# EAGLE design manual lsm (EAGLE 9.2.2)
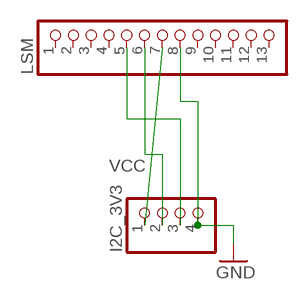
[diagram p0: schematic, sheet 1]

## Parts
I2C_3V3  PINHD-1X4  [1X04]
LSM  PINHD-1X13  [1X13]

## Nets
GND: I2C_3V3.4 LSM.8
N$1: I2C_3V3.2 LSM.6
N$2: I2C_3V3.3 LSM.5
VCC: I2C_3V3.1 LSM.7
Unconnected: LSM.1 LSM.2 LSM.3 LSM.4 LSM.9 LSM.10 LSM.11 LSM.12 LSM.13

## Library data of the parts
I2C_3V3 = pinhead:PINHD-1X4: PIN HEADER
LSM = pinhead:PINHD-1X13: PIN HEADER

## Board
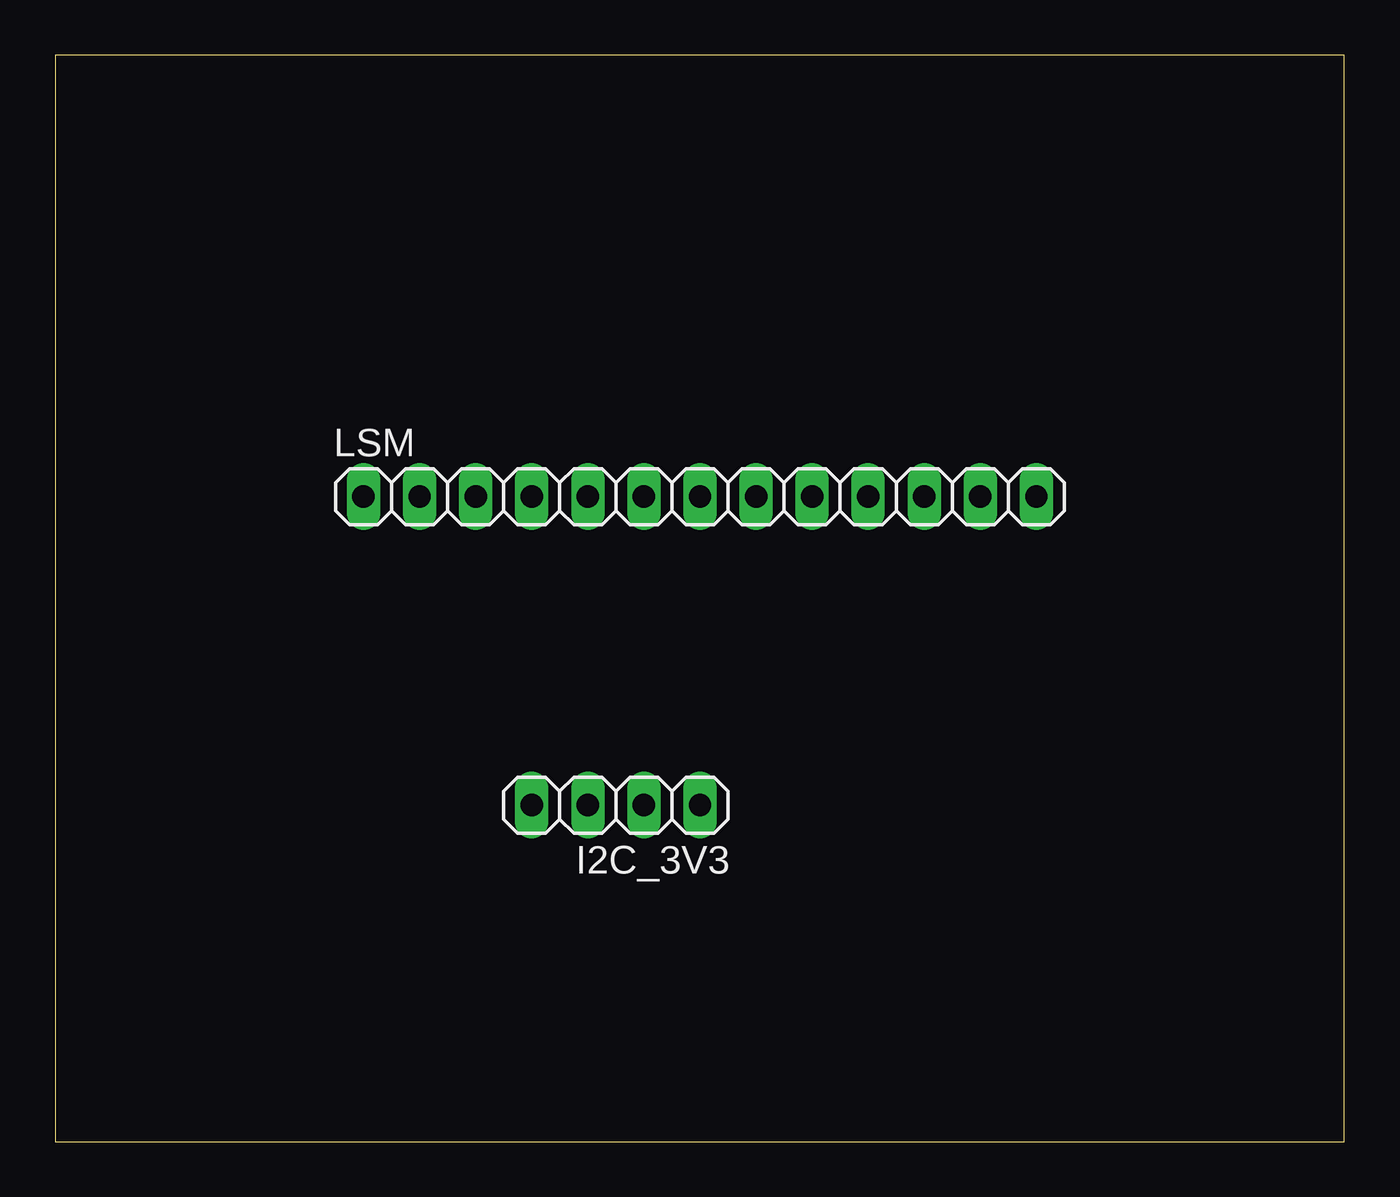
[diagram p1: board, top side]
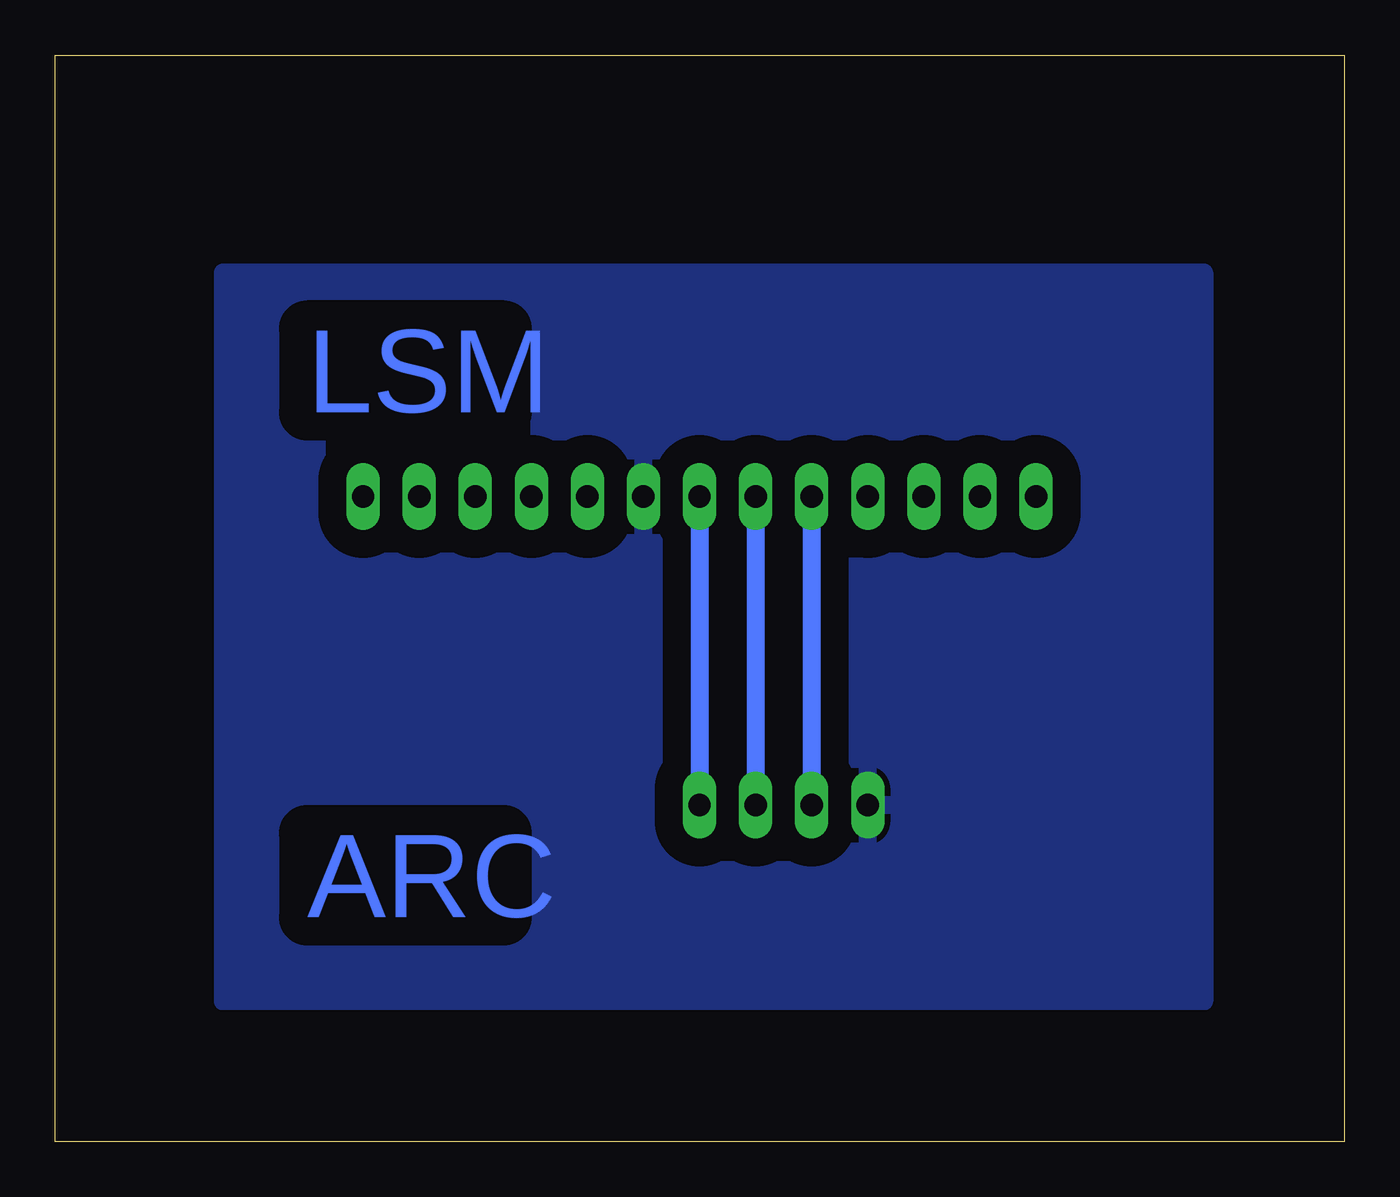
[diagram p2: board, bottom side, seen from below]

Size 58.4 x 49.2 mm. Coordinates in mm from the lower left corner, seen from the top.
Outline: 0,0 58.4,0 58.4,49.2 0,49.2 0,0
Copper layers (1*16): Top 0.035mm / dielectric 1.5mm / Bottom 0.035mm
Design rules "default": minimum track width 6mil, minimum drill 0.35mm, track to track 6mil, track to pad 6mil, pad to pad 6mil, via to via 6mil, smd to smd 6mil, copper to edge 40mil, drill to drill 6mil, minimum pad ring 10mil, minimum via ring 8mil, stop-mask expansion 4mil, vias tented up to drill 0mil, thermal gap 10mil

### Footprints (pad centres in the part's own frame; a part is rotated, then mirrored left to right if it is on the bottom)
1X04 = drill 1.016 long: 1 -3.81,0; 2 -1.27,0; 3 1.27,0; 4 3.81,0
1X13 = drill 1.016 long: 1 -15.24,0; 2 -12.7,0; 3 -10.16,0; 4 -7.62,0; 5 -5.08,0; 6 -2.54,0; 7 0,0; 8 2.54,0; 9 5.08,0; 10 7.62,0; 11 10.16,0; 12 12.7,0; 13 15.24,0

### Placement (x,y rotation side)
I2C_3V3  25.4,15.24 180 top
LSM  29.21,29.21 0 top

### Tracks (layer width: path | path; a pad name or v marks a point on that pad's centre or on a via)
GND
  pour Bottom (isolate 1.27): 6.35,39.37 6.35,6.35 50.8,6.35 50.8,39.37
N$1
  Bottom 0.813: LSM.6 I2C_3V3.2
N$2
  Bottom 0.813: LSM.5 I2C_3V3.3
VCC
  Bottom 0.813: LSM.7 I2C_3V3.1

### Text on the board
Bottom: LSM | ARC